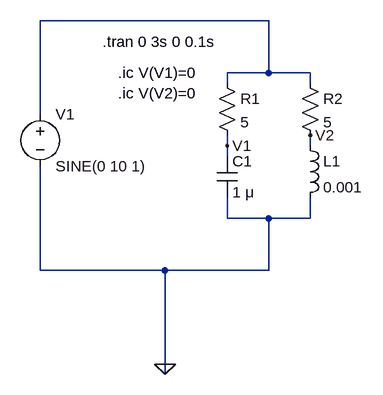
[diagram p0: schematic Q3.asc]
Q3.asc, the LTspice schematic file:
Version 4
SHEET 1 880 680
WIRE 496 128 144 128
WIRE 496 208 496 128
WIRE 496 208 432 208
WIRE 560 208 496 208
WIRE 432 224 432 208
WIRE 560 224 560 208
WIRE 144 272 144 128
WIRE 432 320 432 304
WIRE 560 320 560 304
WIRE 432 336 432 320
WIRE 432 432 432 400
WIRE 496 432 432 432
WIRE 560 432 560 400
WIRE 560 432 496 432
WIRE 144 512 144 352
WIRE 336 512 144 512
WIRE 496 512 496 432
WIRE 496 512 336 512
WIRE 336 656 336 512
WIRE 336 672 336 656
FLAG 336 656 0
FLAG 432 320 V1
FLAG 560 304 V2
SYMBOL voltage 144 256 R0
SYMATTR InstName V1
SYMATTR Value SINE(0 10 1)
SYMBOL res 416 208 R0
SYMATTR InstName R1
SYMATTR Value 5
SYMBOL res 544 208 R0
SYMATTR InstName R2
SYMATTR Value 5
SYMBOL cap 416 336 R0
SYMATTR InstName C1
SYMATTR Value 1 μ
SYMBOL ind 544 304 R0
SYMATTR InstName L1
SYMATTR Value 0.001
TEXT 240 160 Left 2 !.tran 0 3s 0 0.1s
TEXT 264 208 Left 2 !.ic V(V1)=0\n.ic V(V2)=0

The netlist it stands for:
* Q3.asc
V1 N001 0 SINE(0 10 1)
R1 N001 V1 5
R2 N001 V2 5
C1 V1 0 1 μ
L1 V2 0 0.001
.tran 0 3s 0 0.1s
.ic V(V1)=0
.ic V(V2)=0
.backanno
.end